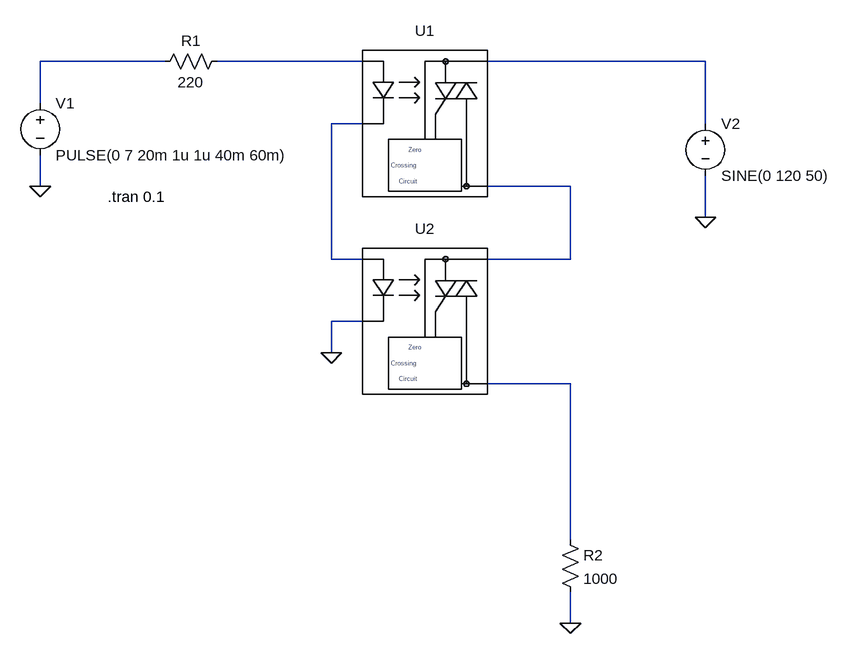
[diagram p0: schematic MOC3083_Dual_Block.asc]
MOC3083_Dual_Block.asc, the LTspice schematic file:
Version 4.1
SHEET 1 880 916
WIRE -544 32 -736 32
WIRE -240 32 -464 32
WIRE 288 32 -48 32
WIRE -736 96 -736 32
WIRE -240 128 -288 128
WIRE 288 128 288 32
WIRE -736 224 -736 176
WIRE 80 224 -48 224
WIRE 288 272 288 208
WIRE -288 336 -288 128
WIRE -240 336 -288 336
WIRE 80 336 80 224
WIRE 80 336 -48 336
WIRE -240 432 -288 432
WIRE -288 480 -288 432
WIRE 80 528 -48 528
WIRE 80 768 80 528
WIRE 80 896 80 848
FLAG -736 224 0
FLAG 80 896 0
FLAG 288 272 0
FLAG -288 480 0
SYMBOL res -448 16 R90
WINDOW 0 0 56 VBottom 2
WINDOW 3 32 56 VTop 2
SYMATTR InstName R1
SYMATTR Value 220
SYMBOL voltage -736 80 R0
WINDOW 123 0 0 Left 0
WINDOW 39 0 0 Left 0
SYMATTR InstName V1
SYMATTR Value PULSE(0 7 20m 1u 1u 40m 60m)
SYMBOL res 64 752 R0
SYMATTR InstName R2
SYMATTR Value 1000
SYMBOL voltage 288 112 R0
WINDOW 123 0 0 Left 0
WINDOW 39 0 0 Left 0
SYMATTR InstName V2
SYMATTR Value SINE(0 120 50)
SYMBOL Optocouplers\\MOC308X -112 192 R0
SYMATTR InstName U1
SYMBOL Optocouplers\\MOC308X -112 496 R0
SYMATTR InstName U2
TEXT -632 240 Left 2 !.tran 0.1

The netlist it stands for:
* MOC3083_Dual_Block.asc
R1 N002 N001 220
V1 N001 0 PULSE(0 7 20m 1u 1u 40m 60m)
R2 N006 0 1000
V2 N003 0 SINE(0 120 50)
X§U1 N002 N004 N005 N003 MOC3081  ; pins A K MT2 MT1
X§U2 N004 0 N006 N005 MOC3081  ; pins A K MT2 MT1
.tran 0.1
.lib Optocouplers/MOC308x.lib
.backanno
.end